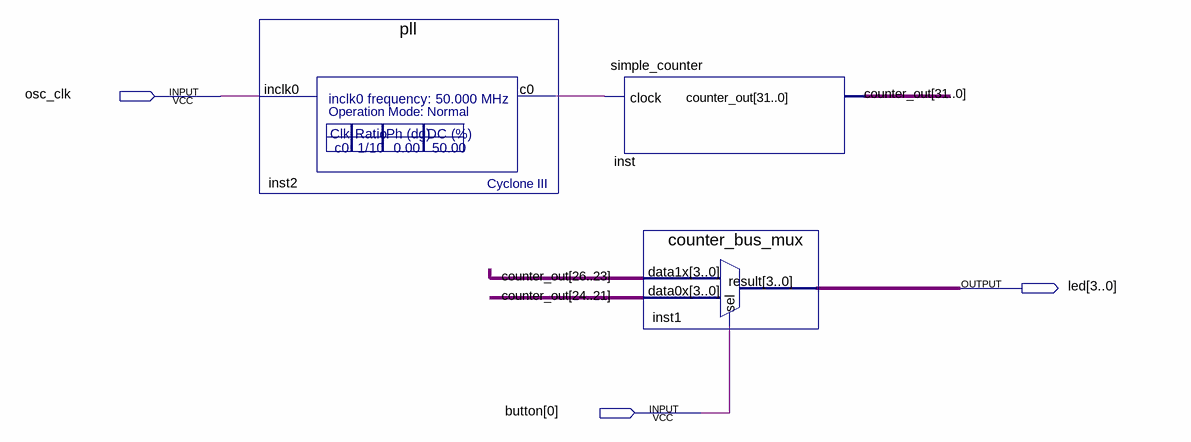
[diagram p0: schematic sheet]
// Quartus schematic counting_matts_top.bdf as structural Verilog: 3 symbols, 3 pins
module counting_matts_top (
  input  osc_clk,
  input  [0:0] button,
  output [3:0] led
);

  wire inst2_c0;
  wire [31:0] counter_out;

  pll inst2 (.inclk0(osc_clk), .c0(inst2_c0));
  simple_counter inst (.clock(inst2_c0), .counter_out(counter_out));
  counter_bus_mux inst1 (.data1x(counter_out[26:23]), .data0x(counter_out[24:21]), .sel(button[0]), .result(led));
endmodule
